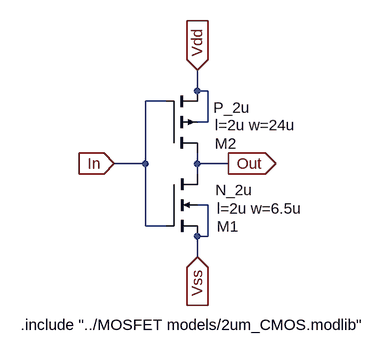
[diagram p0: schematic NOT.asc]
NOT.asc, the LTspice schematic file:
Version 4
SHEET 1 880 680
WIRE 192 64 192 32
WIRE 208 64 192 64
WIRE 144 80 112 80
WIRE 208 112 208 64
WIRE 208 112 192 112
WIRE 112 176 112 80
WIRE 112 176 64 176
WIRE 192 176 192 160
WIRE 240 176 192 176
WIRE 192 192 192 176
WIRE 208 240 192 240
WIRE 112 272 112 176
WIRE 144 272 112 272
WIRE 208 288 208 240
WIRE 208 288 192 288
WIRE 192 320 192 288
FLAG 192 32 Vdd
IOPIN 192 32 In
FLAG 192 320 Vss
IOPIN 192 320 In
FLAG 64 176 In
IOPIN 64 176 In
FLAG 240 176 Out
IOPIN 240 176 Out
SYMBOL nmos4 144 192 R0
WINDOW 0 78 81 Left 2
WINDOW 3 76 25 Left 2
WINDOW 123 78 53 Left 2
SYMATTR InstName M1
SYMATTR Value N_2u
SYMATTR Value2 l=2u w=6.5u
SYMBOL pmos4 144 160 M180
WINDOW 0 75 15 Left 2
WINDOW 3 73 70 Left 2
WINDOW 123 75 43 Left 2
SYMATTR InstName M2
SYMATTR Value P_2u
SYMATTR Value2 l=2u w=24u
TEXT -80 424 Left 2 !.include "../MOSFET models/2um_CMOS.modlib"

The netlist it stands for:
* NOT.asc
M1 Out In Vss Vss N_2u l=2u w=6.5u
M2 Out In Vdd Vdd P_2u l=2u w=24u
.model NMOS NMOS
.model PMOS PMOS
.lib standard.mos
.include "../MOSFET models/2um_CMOS.modlib"
.backanno
.end